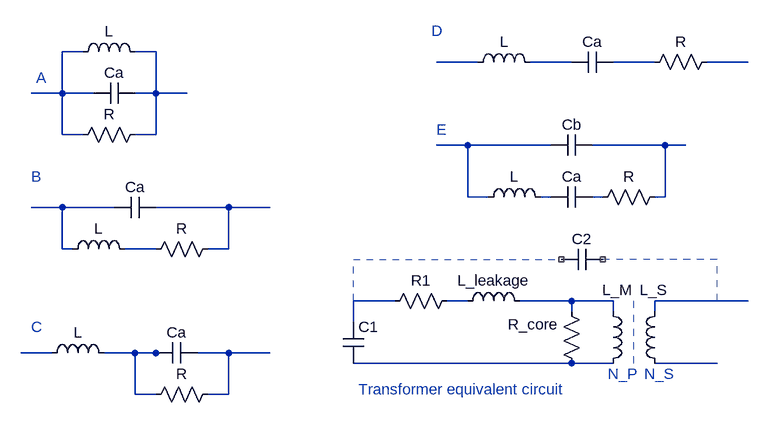
[diagram p0: schematic equivalent-circuit-impedance.asc]
equivalent-circuit-impedance.asc, the LTspice schematic file:
Version 4
SHEET 1 880 680
WIRE -256 -48 -288 -48
WIRE -144 -48 -176 -48
WIRE 352 -32 288 -32
WIRE 496 -32 432 -32
WIRE 624 -32 560 -32
WIRE 768 -32 704 -32
WIRE -288 16 -288 -48
WIRE -288 16 -336 16
WIRE -240 16 -288 16
WIRE -144 16 -144 -48
WIRE -144 16 -176 16
WIRE -96 16 -144 16
WIRE -288 80 -288 16
WIRE -256 80 -288 80
WIRE -144 80 -144 16
WIRE -144 80 -176 80
WIRE 336 96 288 96
WIRE 464 96 336 96
WIRE 640 96 528 96
WIRE 672 96 640 96
WIRE 336 176 336 96
WIRE 368 176 336 176
WIRE 464 176 448 176
WIRE 544 176 528 176
WIRE 640 176 640 96
WIRE 640 176 624 176
WIRE -288 192 -336 192
WIRE -208 192 -288 192
WIRE -32 192 -144 192
WIRE 32 192 -32 192
WIRE -288 256 -288 192
WIRE -272 256 -288 256
WIRE -144 256 -192 256
WIRE -32 256 -32 192
WIRE -32 256 -64 256
WIRE 224 336 160 336
WIRE 336 336 304 336
WIRE 496 336 416 336
WIRE 560 336 496 336
WIRE 768 336 624 336
WIRE 496 352 496 336
WIRE 560 352 560 336
WIRE 624 352 624 336
WIRE 160 368 160 336
WIRE -304 416 -352 416
WIRE -176 416 -224 416
WIRE -144 416 -176 416
WIRE -128 416 -144 416
WIRE -32 416 -80 416
WIRE 32 416 -32 416
WIRE 496 432 160 432
WIRE 560 432 496 432
WIRE 720 432 624 432
WIRE -176 480 -176 416
WIRE -144 480 -176 480
WIRE -32 480 -32 416
WIRE -32 480 -64 480
SYMBOL ind -272 -32 R270
WINDOW 0 32 56 VTop 2
WINDOW 3 5 56 VBottom 2
SYMATTR InstName L
SYMATTR Value ""
SYMBOL cap -176 0 R90
WINDOW 0 0 32 VBottom 2
WINDOW 3 32 32 VTop 2
SYMATTR InstName Ca
SYMATTR Value ""
SYMBOL res -160 64 R90
WINDOW 0 0 56 VBottom 2
WINDOW 3 32 56 VTop 2
SYMATTR InstName R
SYMATTR Value ""
SYMBOL cap -144 176 R90
WINDOW 0 0 32 VBottom 2
WINDOW 3 32 32 VTop 2
SYMATTR InstName Ca
SYMATTR Value ""
SYMBOL ind -288 272 R270
WINDOW 0 32 56 VTop 2
WINDOW 3 5 56 VBottom 2
SYMATTR InstName L
SYMATTR Value ""
SYMBOL res -160 272 R270
WINDOW 0 32 56 VTop 2
WINDOW 3 0 56 VBottom 2
SYMATTR InstName R
SYMATTR Value ""
SYMBOL ind -320 432 R270
WINDOW 0 32 56 VTop 2
WINDOW 3 5 56 VBottom 2
SYMATTR InstName L
SYMATTR Value ""
SYMBOL cap -80 400 R90
WINDOW 0 0 32 VBottom 2
WINDOW 3 32 32 VTop 2
SYMATTR InstName Ca
SYMATTR Value ""
SYMBOL res -160 496 R270
WINDOW 0 32 56 VTop 2
WINDOW 3 0 56 VBottom 2
SYMATTR InstName R
SYMATTR Value ""
SYMBOL ind 336 -16 R270
WINDOW 0 32 56 VTop 2
WINDOW 3 5 56 VBottom 2
SYMATTR InstName L
SYMATTR Value ""
SYMBOL cap 560 -48 R90
WINDOW 0 0 32 VBottom 2
WINDOW 3 32 32 VTop 2
SYMATTR InstName Ca
SYMATTR Value ""
SYMBOL res 720 -48 R90
WINDOW 0 0 56 VBottom 2
WINDOW 3 32 56 VTop 2
SYMATTR InstName R
SYMATTR Value ""
SYMBOL res 640 160 R90
WINDOW 0 0 56 VBottom 2
WINDOW 3 32 56 VTop 2
SYMATTR InstName R
SYMATTR Value ""
SYMBOL cap 528 80 R90
WINDOW 0 0 32 VBottom 2
WINDOW 3 32 32 VTop 2
SYMATTR InstName Cb
SYMATTR Value ""
SYMBOL cap 528 160 R90
WINDOW 0 0 32 VBottom 2
WINDOW 3 32 32 VTop 2
SYMATTR InstName Ca
SYMATTR Value ""
SYMBOL ind 352 192 R270
WINDOW 0 32 56 VTop 2
WINDOW 3 5 56 VBottom 2
SYMATTR InstName L
SYMATTR Value ""
SYMBOL res 320 320 R90
WINDOW 0 0 56 VBottom 2
WINDOW 3 32 56 VTop 2
SYMATTR InstName R1
SYMATTR Value ""
SYMBOL res 512 448 R180
WINDOW 0 36 76 Left 2
WINDOW 3 36 40 Left 2
SYMATTR InstName R_core
SYMATTR Value ""
SYMBOL ind 544 336 R0
WINDOW 0 -1 -17 Left 2
SYMATTR InstName L_M
SYMATTR Value ""
SYMBOL ind 320 352 R270
WINDOW 0 32 56 VTop 2
WINDOW 3 5 56 VBottom 2
SYMATTR InstName L_leakage
SYMATTR Value ""
SYMBOL ind 640 336 M0
WINDOW 0 -4 -17 Left 2
SYMATTR InstName L_S
SYMATTR Value ""
SYMBOL cap 144 368 R0
SYMATTR InstName C1
SYMATTR Value ""
SYMBOL cap 544 256 R90
WINDOW 0 0 32 VBottom 2
WINDOW 3 32 32 VTop 2
SYMATTR InstName C2
SYMATTR Value ""
TEXT -328 -8 Left 2 ;A
TEXT -336 144 Left 2 ;B
TEXT -336 376 Left 2 ;C
TEXT 280 -80 Left 2 ;D
TEXT 288 72 Left 2 ;E
TEXT 552 448 Left 2 ;N_P
TEXT 608 448 Left 2 ;N_S
TEXT 168 472 Left 2 ;Transformer equivalent circuit
LINE Normal 592 432 592 336 2
LINE Normal 160 272 480 272 2
LINE Normal 160 336 160 272 2
LINE Normal 720 272 544 272 2
LINE Normal 720 336 720 272 2

The netlist it stands for:
* equivalent-circuit-impedance.asc
L N001 N002
Ca N002 N001
R N002 N001
Ca N012 N011
L N011 N013
R N013 N012
L N018 N019
Ca N020 N019
R N019 N020
L N003 N004
Ca N005 N004
R N006 N005
R N008 N010
Cb N008 N007
Ca N010 N009
L N007 N009
R1 N015 N014
R_core N021 N016
L_M N016 N021
L_leakage N015 N016
L_S N017 N022
C1 N014 N021
C2 NC_01 NC_02
* A
* B
* C
* D
* E
* N_P
* N_S
* Transformer equivalent circuit
.backanno
.end